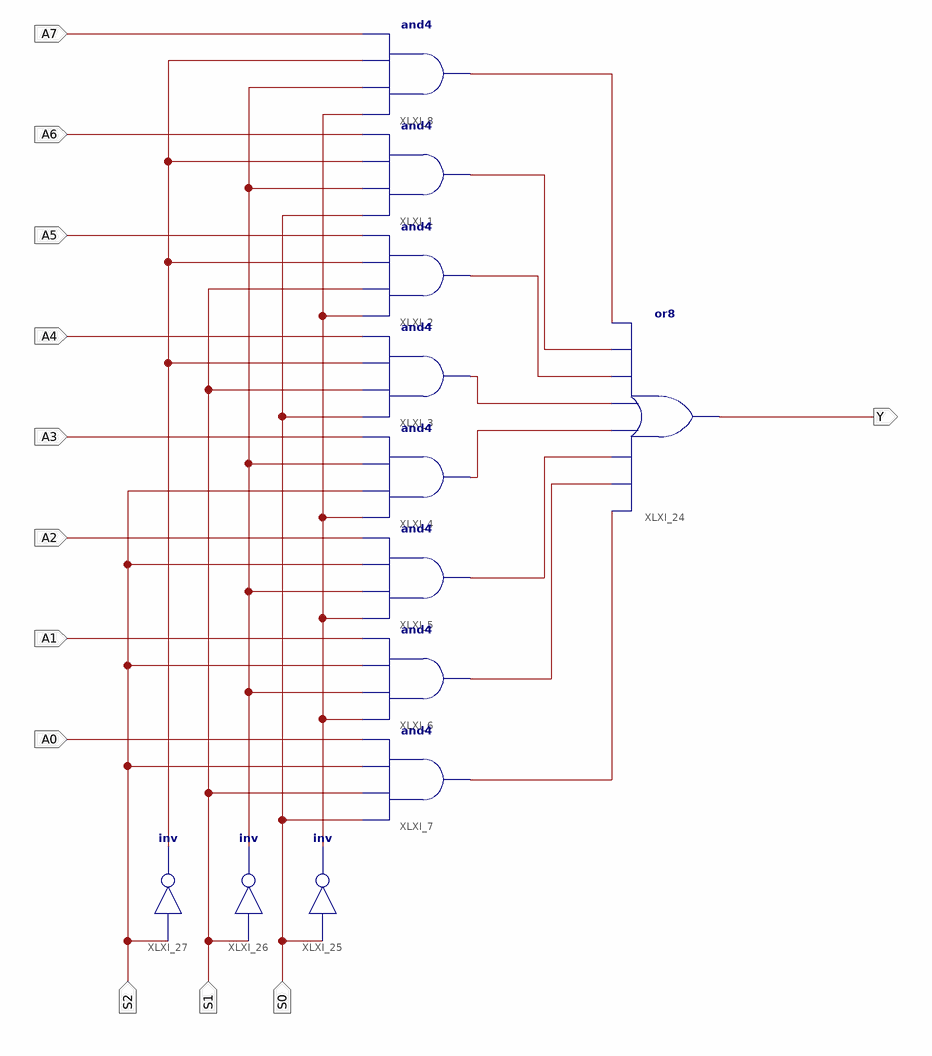
[diagram p0: schematic sheet 1]
// Xilinx ISE schematic mux8to1.sch (spartan3e) as structural Verilog: 12 symbols, 12 ports
module mux8to1 (
  input  A7,
  input  A6,
  input  A5,
  input  A4,
  input  A3,
  input  A2,
  input  A1,
  input  A0,
  input  S0,
  input  S1,
  input  S2,
  output Y
);

  wire XLXN_1, XLXN_2, XLXN_3, XLXN_4, XLXN_5, XLXN_6, XLXN_7, XLXN_8, XLXN_33, XLXN_35, XLXN_36;

  and XLXI_1 (XLXN_2, S0, XLXN_35, XLXN_36, A6);
  and XLXI_2 (XLXN_3, XLXN_33, S1, XLXN_36, A5);
  and XLXI_3 (XLXN_4, S0, S1, XLXN_36, A4);
  and XLXI_4 (XLXN_5, XLXN_33, S2, XLXN_35, A3);
  and XLXI_5 (XLXN_6, XLXN_33, XLXN_35, S2, A2);
  and XLXI_6 (XLXN_7, XLXN_33, XLXN_35, S2, A1);
  and XLXI_8 (XLXN_1, XLXN_33, XLXN_35, XLXN_36, A7);
  and XLXI_7 (XLXN_8, S0, S1, S2, A0);
  or XLXI_24 (Y, XLXN_8, XLXN_7, XLXN_6, XLXN_5, XLXN_4, XLXN_3, XLXN_2, XLXN_1);
  not XLXI_25 (XLXN_33, S0);
  not XLXI_26 (XLXN_35, S1);
  not XLXI_27 (XLXN_36, S2);
endmodule
